# EAGLE schematic controller-ha-v2 (EAGLE 6.5.0)
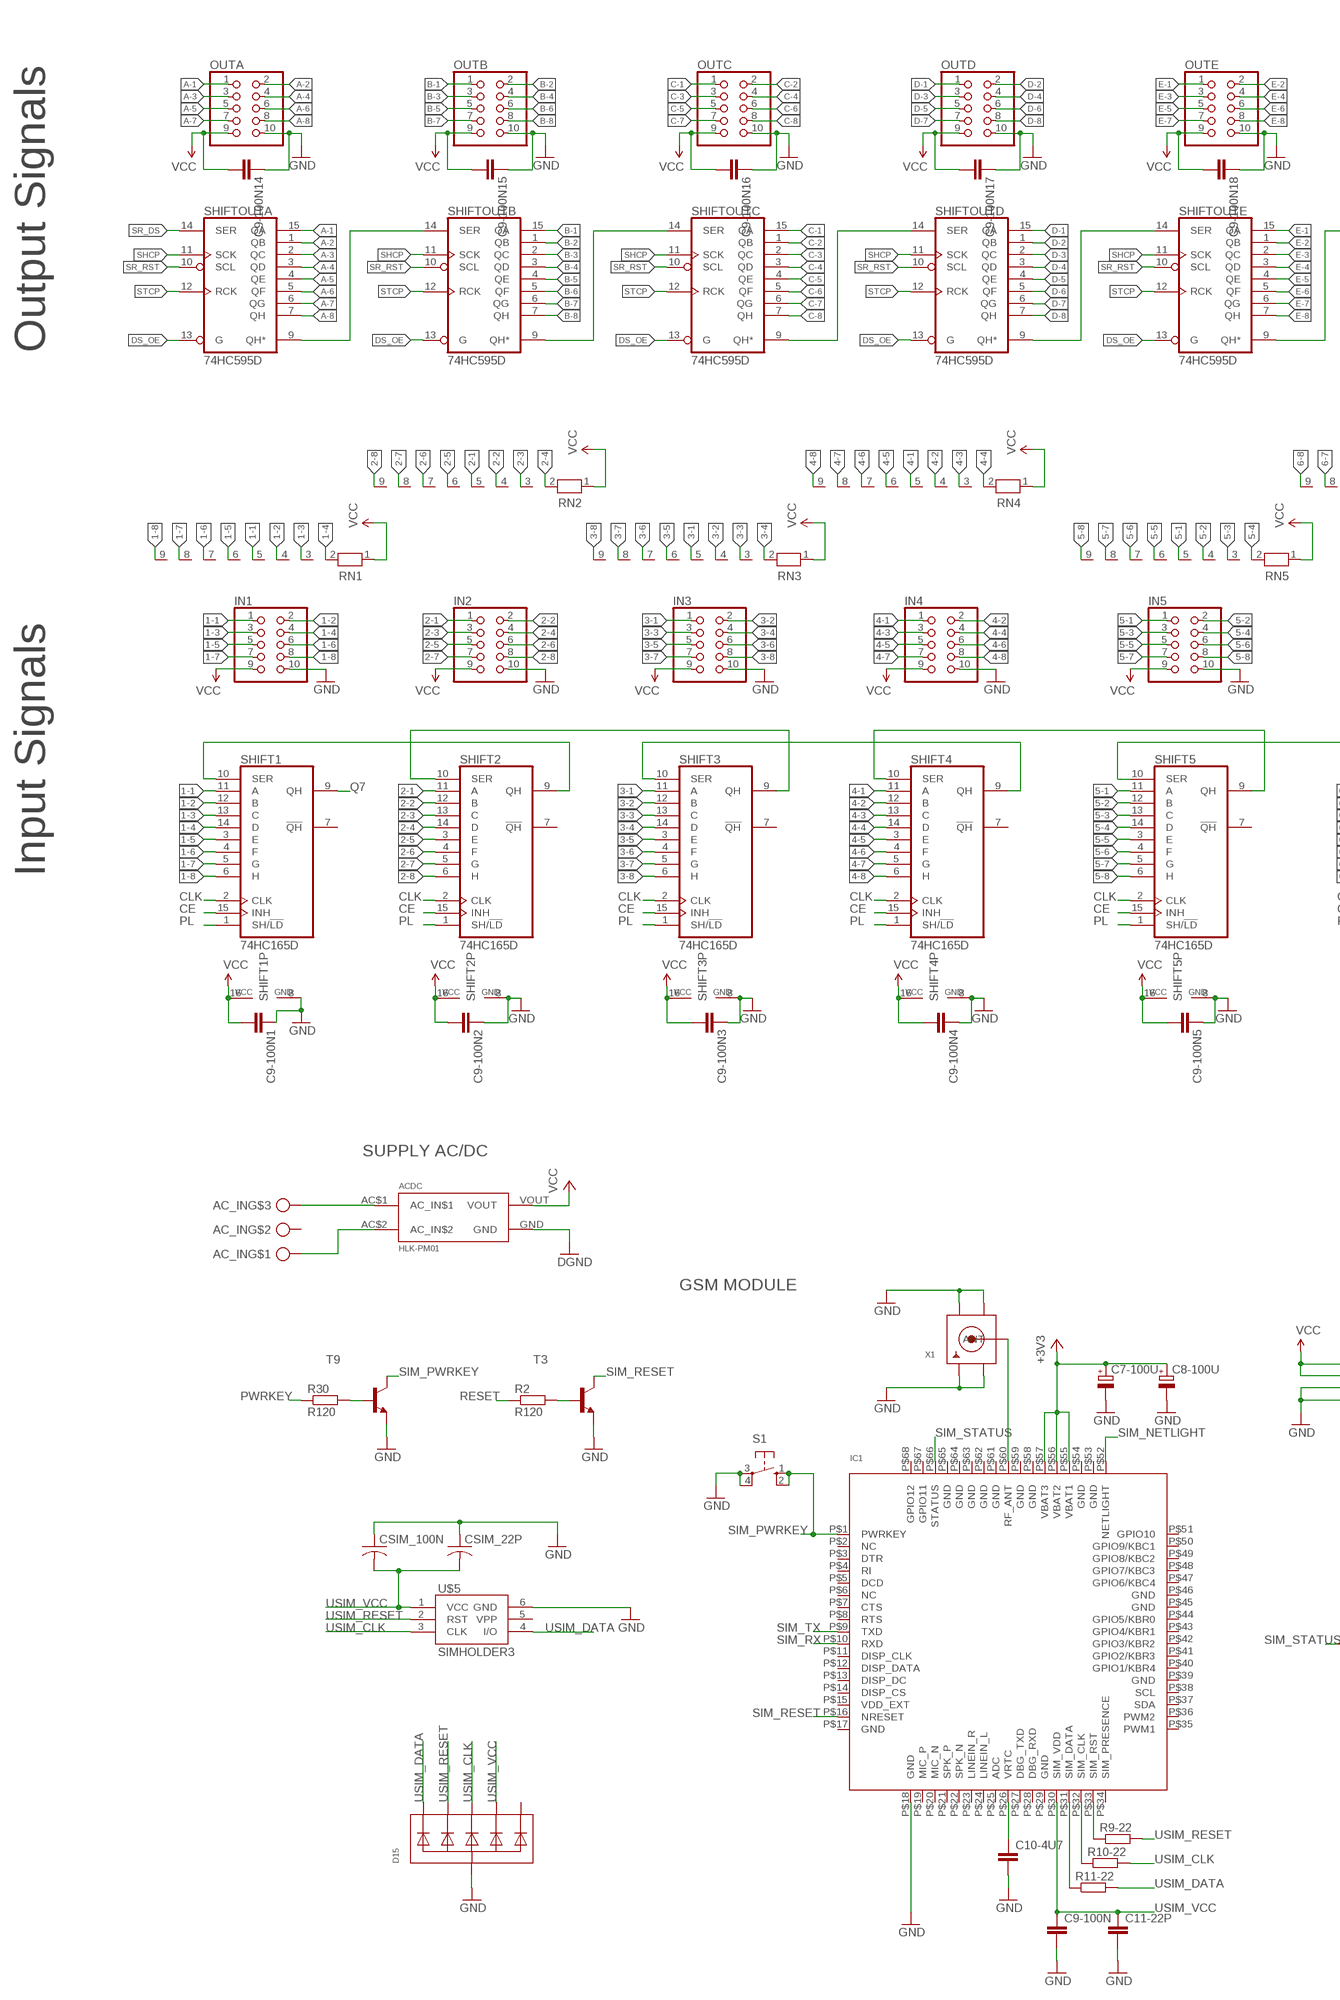
[diagram p0: schematic, sheet 1, part 1 of 2]
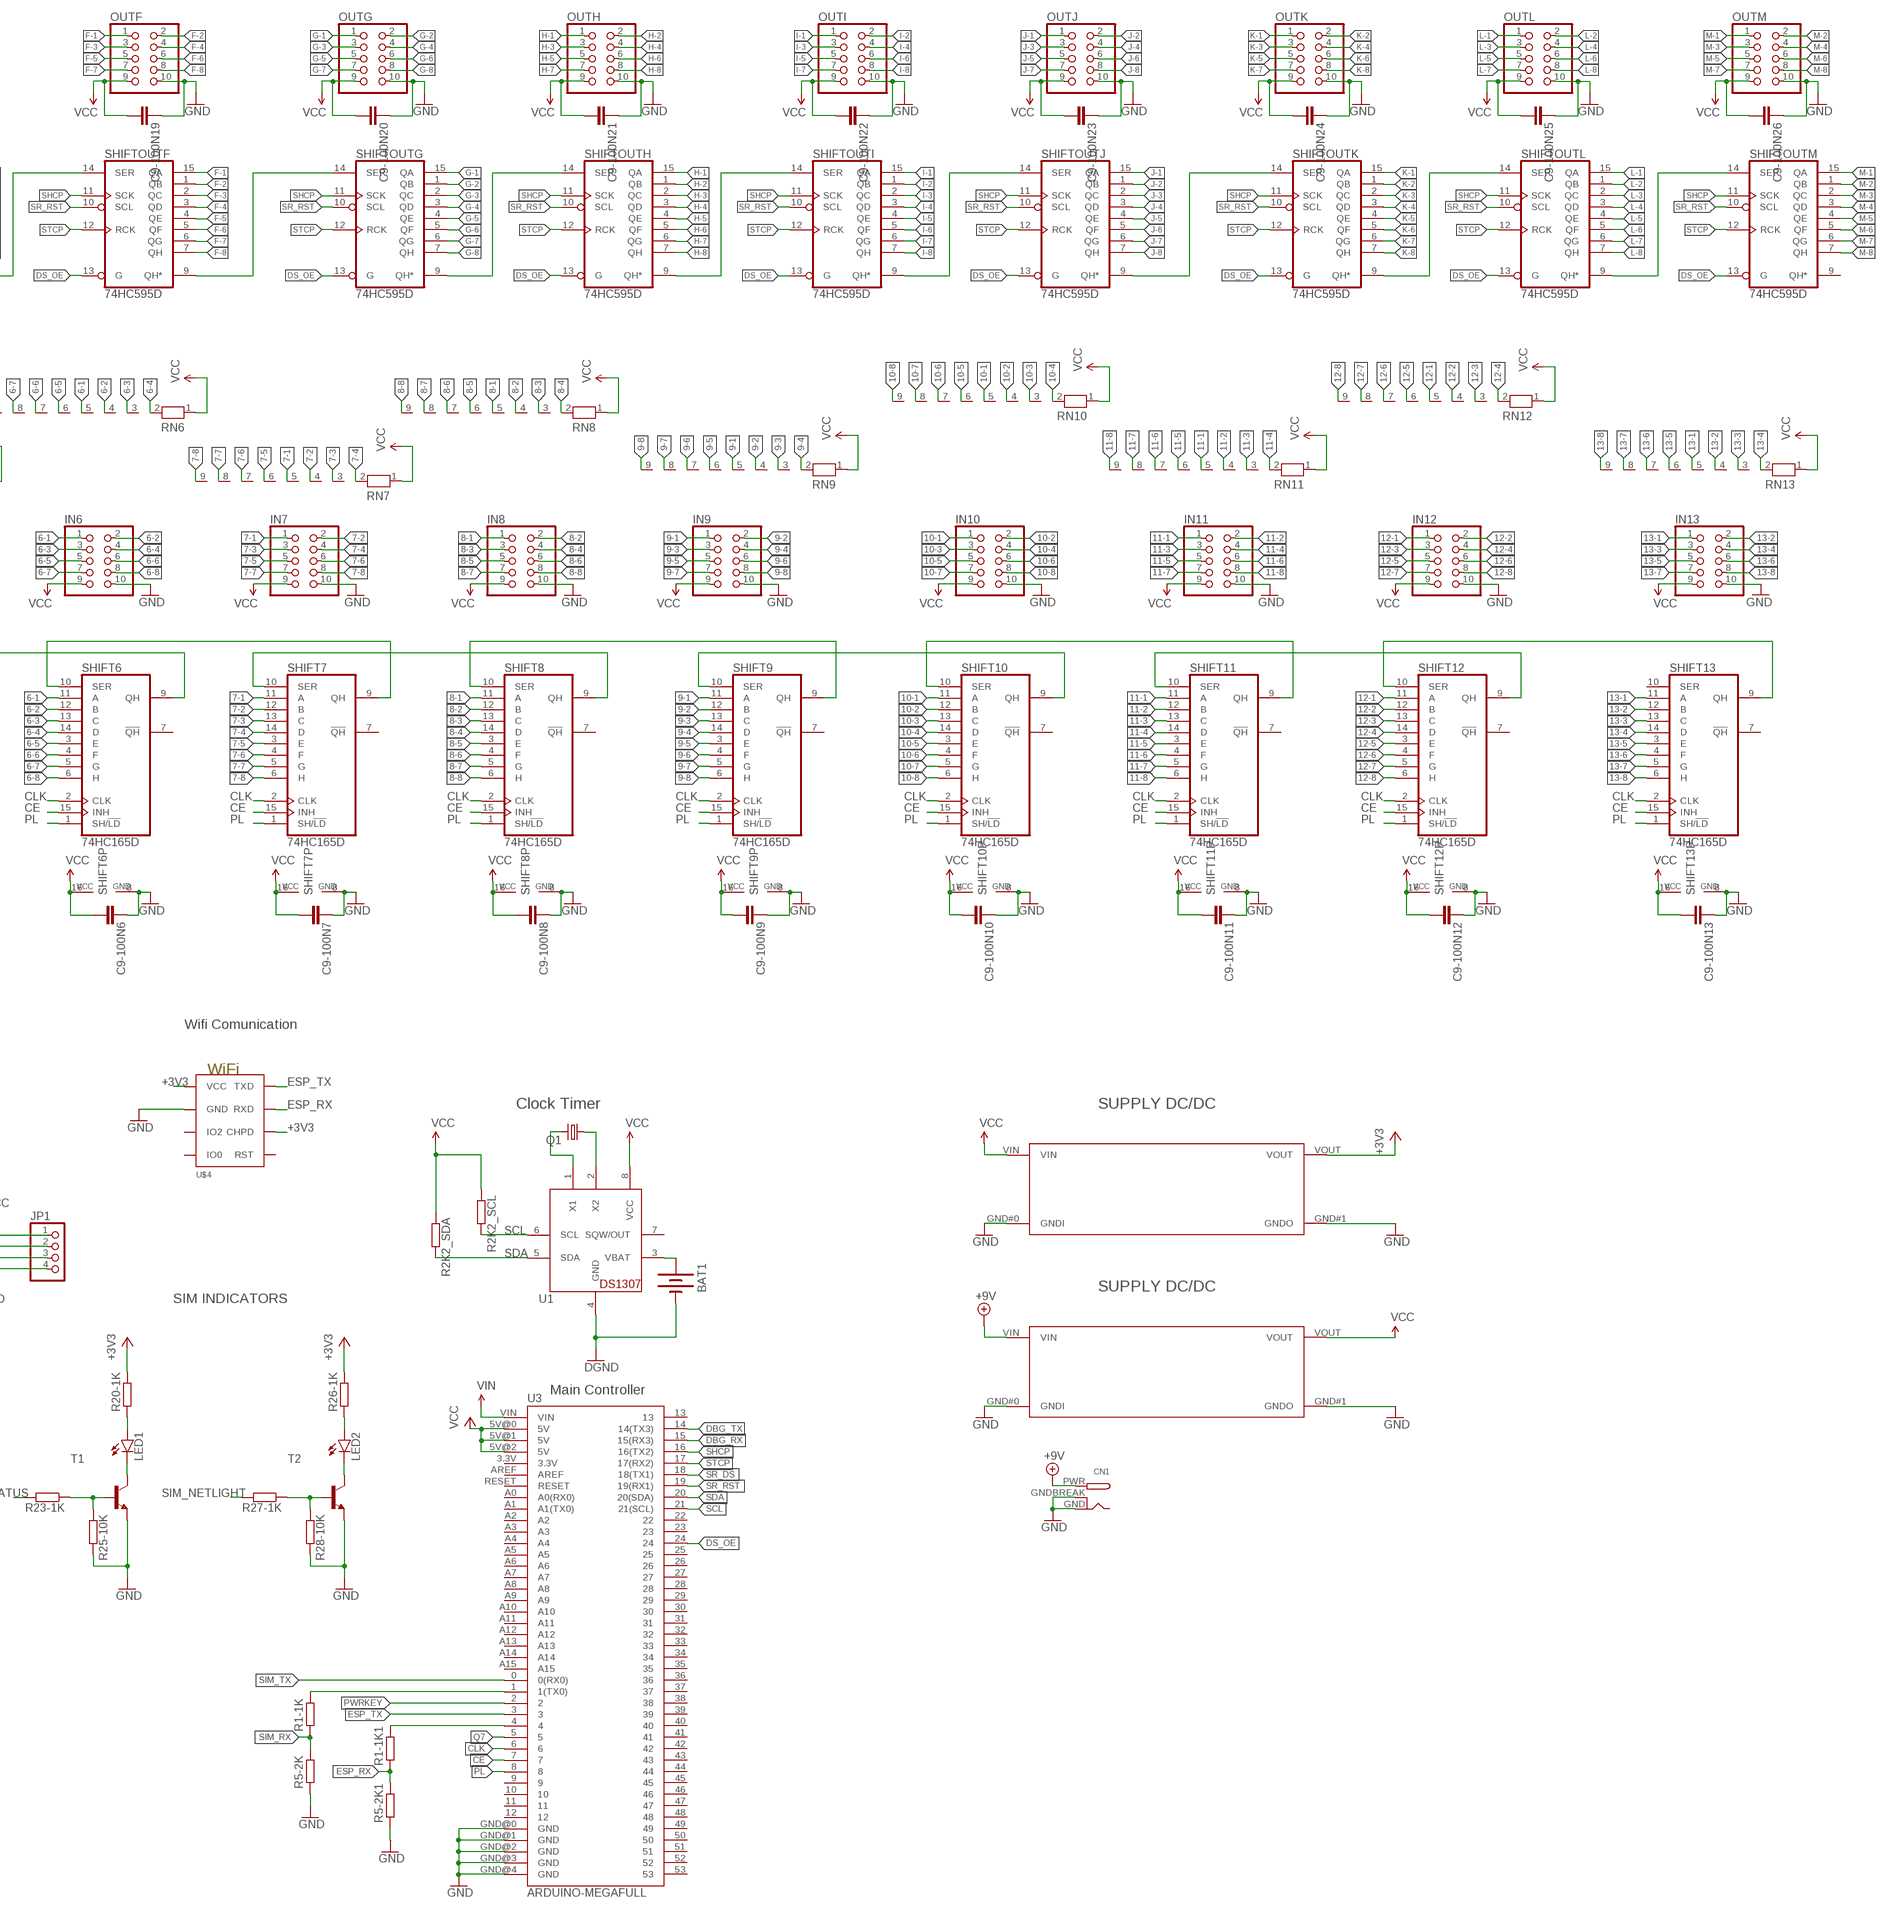
[diagram p1: schematic, sheet 1, part 2 of 2]

## Parts
AC_IN  AK3003  [AK3003]
ACDC  HLK-PM01  [HLK-PM01]
BAT1  BATTERY20PTH  [BATTCOM_20MM_PTH]
C7-100U  CPOL-EU153CLV-0605  [153CLV-0605]
C8-100U  CPOL-EU153CLV-0605  [153CLV-0605]
C9-100N  C-EUC0603  [C0603]
C9-100N1  C-EUC0603  [C0603]
C9-100N2  C-EUC0603  [C0603]
C9-100N3  C-EUC0603  [C0603]
C9-100N4  C-EUC0603  [C0603]
C9-100N5  C-EUC0603  [C0603]
C9-100N6  C-EUC0603  [C0603]
C9-100N7  C-EUC0603  [C0603]
C9-100N8  C-EUC0603  [C0603]
C9-100N9  C-EUC0603  [C0603]
C9-100N10  C-EUC0603  [C0603]
C9-100N11  C-EUC0603  [C0603]
C9-100N12  C-EUC0603  [C0603]
C9-100N13  C-EUC0603  [C0603]
C9-100N14  C-EUC0603  [C0603]
C9-100N15  C-EUC0603  [C0603]
C9-100N16  C-EUC0603  [C0603]
C9-100N17  C-EUC0603  [C0603]
C9-100N18  C-EUC0603  [C0603]
C9-100N19  C-EUC0603  [C0603]
C9-100N20  C-EUC0603  [C0603]
C9-100N21  C-EUC0603  [C0603]
C9-100N22  C-EUC0603  [C0603]
C9-100N23  C-EUC0603  [C0603]
C9-100N24  C-EUC0603  [C0603]
C9-100N25  C-EUC0603  [C0603]
C9-100N26  C-EUC0603  [C0603]
C10-4U7  C-EUC0603  [C0603]
C11-22P  C-EUC0603  [C0603]
CN1  DCBARRELPTH  [DCJACK_2MM_PTH]
CSIM_22P  C-USC0603K  [C0603K]
CSIM_100N  C-USC0603K  [C0603K]
D15  TVSARRAY_5LANE  [SOT363]
IC1  GSM_SIM900_LITERAL  [SIM900_SMT]
IN1  PINHD-2X5  [2X05]
IN2  PINHD-2X5  [2X05]
IN3  PINHD-2X5  [2X05]
IN4  PINHD-2X5  [2X05]
IN5  PINHD-2X5  [2X05]
IN6  PINHD-2X5  [2X05]
IN7  PINHD-2X5  [2X05]
IN8  PINHD-2X5  [2X05]
IN9  PINHD-2X5  [2X05]
IN10  PINHD-2X5  [2X05]
IN11  PINHD-2X5  [2X05]
IN12  PINHD-2X5  [2X05]
IN13  PINHD-2X5  [2X05]
JP1  PINHD-1X4  [1X04]
LED1  LED-3MM-NO_SILK  [LED3MM-NS]
LED2  LED-3MM-NO_SILK  [LED3MM-NS]
OUTA  PINHD-2X5  [2X05]
OUTB  PINHD-2X5  [2X05]
OUTC  PINHD-2X5  [2X05]
OUTD  PINHD-2X5  [2X05]
OUTE  PINHD-2X5  [2X05]
OUTF  PINHD-2X5  [2X05]
OUTG  PINHD-2X5  [2X05]
OUTH  PINHD-2X5  [2X05]
OUTI  PINHD-2X5  [2X05]
OUTJ  PINHD-2X5  [2X05]
OUTK  PINHD-2X5  [2X05]
OUTL  PINHD-2X5  [2X05]
OUTM  PINHD-2X5  [2X05]
Q1  CRYSTALTC26H  [TC26H]
R1-1K  R-EU_R0603  [R0603]
R1-1K1  R-EU_R0603  [R0603]
R2  R120  R-EU_M0805  [M0805]
R2K2_SCL  R-EU_R0603  [R0603]
R2K2_SDA  R-EU_R0603  [R0603]
R5-2K  R-EU_R0603  [R0603]
R5-2K1  R-EU_R0603  [R0603]
R9-22  R-EU_R0603  [R0603]
R10-22  R-EU_R0603  [R0603]
R11-22  R-EU_R0603  [R0603]
R20-1K  R-EU_R0603  [R0603]
R23-1K  R-EU_R0603  [R0603]
R25-10K  R-EU_R0603  [R0603]
R26-1K  R-EU_R0603  [R0603]
R27-1K  R-EU_R0603  [R0603]
R28-10K  R-EU_R0603  [R0603]
R30  R120  R-EU_M0805  [M0805]
RN1  RN08  [RN-9]
RN2  RN08  [RN-9]
RN3  RN08  [RN-9]
RN4  RN08  [RN-9]
RN5  RN08  [RN-9]
RN6  RN08  [RN-9]
RN7  RN08  [RN-9]
RN8  RN08  [RN-9]
RN9  RN08  [RN-9]
RN10  RN08  [RN-9]
RN11  RN08  [RN-9]
RN12  RN08  [RN-9]
RN13  RN08  [RN-9]
S1  10-XX  [B3F-10XX]
SHIFT1  74HC165D  [SO16]
SHIFT2  74HC165D  [SO16]
SHIFT3  74HC165D  [SO16]
SHIFT4  74HC165D  [SO16]
SHIFT5  74HC165D  [SO16]
SHIFT6  74HC165D  [SO16]
SHIFT7  74HC165D  [SO16]
SHIFT8  74HC165D  [SO16]
SHIFT9  74HC165D  [SO16]
SHIFT10  74HC165D  [SO16]
SHIFT11  74HC165D  [SO16]
SHIFT12  74HC165D  [SO16]
SHIFT13  74HC165D  [SO16]
SHIFTOUTA  74HC595D  [SO16]
SHIFTOUTB  74HC595D  [SO16]
SHIFTOUTC  74HC595D  [SO16]
SHIFTOUTD  74HC595D  [SO16]
SHIFTOUTE  74HC595D  [SO16]
SHIFTOUTF  74HC595D  [SO16]
SHIFTOUTG  74HC595D  [SO16]
SHIFTOUTH  74HC595D  [SO16]
SHIFTOUTI  74HC595D  [SO16]
SHIFTOUTJ  74HC595D  [SO16]
SHIFTOUTK  74HC595D  [SO16]
SHIFTOUTL  74HC595D  [SO16]
SHIFTOUTM  74HC595D  [SO16]
T1  MMBT2222ALT1-NPN-SOT23-BEC  [SOT23-BEC]
T2  MMBT2222ALT1-NPN-SOT23-BEC  [SOT23-BEC]
T3  MMBT2222ALT1-NPN-SOT23-BEC  [SOT23-BEC]
T9  MMBT2222ALT1-NPN-SOT23-BEC  [SOT23-BEC]
U1  DS1307  [DIL08]
U3  ARDUINO-MEGAFULL  [ARDUINO_MEGA]
U$1  DCDCMODULE  [DCDCMODULE]
U$2  DCDCMODULE  [DCDCMODULE]
U$4  ESP8266  [ESP8266]
U$5  SIMHOLDER3  [SIMHOLDER3]
X1  SMACONNECTOR  [SMA90_DIP]

## Nets
1-1: IN1.1 RN1.5 SHIFT1.11(A)
1-2: IN1.2 RN1.4 SHIFT1.12(B)
1-3: IN1.3 RN1.3 SHIFT1.13(C)
1-4: IN1.4 RN1.2 SHIFT1.14(D)
1-5: IN1.5 RN1.6 SHIFT1.3(E)
1-6: IN1.6 RN1.7 SHIFT1.4(F)
1-7: IN1.7 RN1.8 SHIFT1.5(G)
1-8: IN1.8 RN1.9 SHIFT1.6(H)
2-1: IN2.1 RN2.5 SHIFT2.11(A)
2-2: IN2.2 RN2.4 SHIFT2.12(B)
2-3: IN2.3 RN2.3 SHIFT2.13(C)
2-4: IN2.4 RN2.2 SHIFT2.14(D)
2-5: IN2.5 RN2.6 SHIFT2.3(E)
2-6: IN2.6 RN2.7 SHIFT2.4(F)
2-7: IN2.7 RN2.8 SHIFT2.5(G)
2-8: IN2.8 RN2.9 SHIFT2.6(H)
3-1: IN3.1 RN3.5 SHIFT3.11(A)
3-2: IN3.2 RN3.4 SHIFT3.12(B)
3-3: IN3.3 RN3.3 SHIFT3.13(C)
3-4: IN3.4 RN3.2 SHIFT3.14(D)
3-5: IN3.5 RN3.6 SHIFT3.3(E)
3-6: IN3.6 RN3.7 SHIFT3.4(F)
3-7: IN3.7 RN3.8 SHIFT3.5(G)
3-8: IN3.8 RN3.9 SHIFT3.6(H)
4-1: IN4.1 RN4.5 SHIFT4.11(A)
4-2: IN4.2 RN4.4 SHIFT4.12(B)
4-3: IN4.3 RN4.3 SHIFT4.13(C)
4-4: IN4.4 RN4.2 SHIFT4.14(D)
4-5: IN4.5 RN4.6 SHIFT4.3(E)
4-6: IN4.6 RN4.7 SHIFT4.4(F)
4-7: IN4.7 RN4.8 SHIFT4.5(G)
4-8: IN4.8 RN4.9 SHIFT4.6(H)
5-1: IN5.1 RN5.5 SHIFT5.11(A)
5-2: IN5.2 RN5.4 SHIFT5.12(B)
5-3: IN5.3 RN5.3 SHIFT5.13(C)
5-4: IN5.4 RN5.2 SHIFT5.14(D)
5-5: IN5.5 RN5.6 SHIFT5.3(E)
5-6: IN5.6 RN5.7 SHIFT5.4(F)
5-7: IN5.7 RN5.8 SHIFT5.5(G)
5-8: IN5.8 RN5.9 SHIFT5.6(H)
6-1: IN6.1 RN6.5 SHIFT6.11(A)
6-2: IN6.2 RN6.4 SHIFT6.12(B)
6-3: IN6.3 RN6.3 SHIFT6.13(C)
6-4: IN6.4 RN6.2 SHIFT6.14(D)
6-5: IN6.5 RN6.6 SHIFT6.3(E)
6-6: IN6.6 RN6.7 SHIFT6.4(F)
6-7: IN6.7 RN6.8 SHIFT6.5(G)
6-8: IN6.8 RN6.9 SHIFT6.6(H)
7-1: IN7.1 RN7.5 SHIFT7.11(A)
7-2: IN7.2 RN7.4 SHIFT7.12(B)
7-3: IN7.3 RN7.3 SHIFT7.13(C)
7-4: IN7.4 RN7.2 SHIFT7.14(D)
7-5: IN7.5 RN7.6 SHIFT7.3(E)
7-6: IN7.6 RN7.7 SHIFT7.4(F)
7-7: IN7.7 RN7.8 SHIFT7.5(G)
7-8: IN7.8 RN7.9 SHIFT7.6(H)
8-1: IN8.1 RN8.5 SHIFT8.11(A)
8-2: IN8.2 RN8.4 SHIFT8.12(B)
8-3: IN8.3 RN8.3 SHIFT8.13(C)
8-4: IN8.4 RN8.2 SHIFT8.14(D)
8-5: IN8.5 RN8.6 SHIFT8.3(E)
8-6: IN8.6 RN8.7 SHIFT8.4(F)
8-7: IN8.7 RN8.8 SHIFT8.5(G)
8-8: IN8.8 RN8.9 SHIFT8.6(H)
9-1: IN9.1 RN9.5 SHIFT9.11(A)
9-2: IN9.2 RN9.4 SHIFT9.12(B)
9-3: IN9.3 RN9.3 SHIFT9.13(C)
9-4: IN9.4 RN9.2 SHIFT9.14(D)
9-5: IN9.5 RN9.6 SHIFT9.3(E)
9-6: IN9.6 RN9.7 SHIFT9.4(F)
9-7: IN9.7 RN9.8 SHIFT9.5(G)
9-8: IN9.8 RN9.9 SHIFT9.6(H)
10-1: IN10.1 RN10.5 SHIFT10.11(A)
10-2: IN10.2 RN10.4 SHIFT10.12(B)
10-3: IN10.3 RN10.3 SHIFT10.13(C)
10-4: IN10.4 RN10.2 SHIFT10.14(D)
10-5: IN10.5 RN10.6 SHIFT10.3(E)
10-6: IN10.6 RN10.7 SHIFT10.4(F)
10-7: IN10.7 RN10.8 SHIFT10.5(G)
10-8: IN10.8 RN10.9 SHIFT10.6(H)
11-1: IN11.1 RN11.5 SHIFT11.11(A)
11-2: IN11.2 RN11.4 SHIFT11.12(B)
11-3: IN11.3 RN11.3 SHIFT11.13(C)
11-4: IN11.4 RN11.2 SHIFT11.14(D)
11-5: IN11.5 RN11.6 SHIFT11.3(E)
11-6: IN11.6 RN11.7 SHIFT11.4(F)
11-7: IN11.7 RN11.8 SHIFT11.5(G)
11-8: IN11.8 RN11.9 SHIFT11.6(H)
12-1: IN12.1 RN12.5 SHIFT12.11(A)
12-2: IN12.2 RN12.4 SHIFT12.12(B)
12-3: IN12.3 RN12.3 SHIFT12.13(C)
12-4: IN12.4 RN12.2 SHIFT12.14(D)
12-5: IN12.5 RN12.6 SHIFT12.3(E)
12-6: IN12.6 RN12.7 SHIFT12.4(F)
12-7: IN12.7 RN12.8 SHIFT12.5(G)
12-8: IN12.8 RN12.9 SHIFT12.6(H)
13-1: IN13.1 RN13.5 SHIFT13.11(A)
13-2: IN13.2 RN13.4 SHIFT13.12(B)
13-3: IN13.3 RN13.3 SHIFT13.13(C)
13-4: IN13.4 RN13.2 SHIFT13.14(D)
13-5: IN13.5 RN13.6 SHIFT13.3(E)
13-6: IN13.6 RN13.7 SHIFT13.4(F)
13-7: IN13.7 RN13.8 SHIFT13.5(G)
13-8: IN13.8 RN13.9 SHIFT13.6(H)
+3V3: C7-100U.+ C8-100U.+ IC1.P$55(VBAT1) IC1.P$56(VBAT2) IC1.P$57(VBAT3) R20-1K.2 R26-1K.2 U$2.VOUT U$4.CHPD U$4.VCC
+9V [GND]: CN1.PWR U$1.VIN
A-1: OUTA.1 SHIFTOUTA.15(QA)
A-2: OUTA.2 SHIFTOUTA.1(QB)
A-3: OUTA.3 SHIFTOUTA.2(QC)
A-4: OUTA.4 SHIFTOUTA.3(QD)
A-5: OUTA.5 SHIFTOUTA.4(QE)
A-6: OUTA.6 SHIFTOUTA.5(QF)
A-7: OUTA.7 SHIFTOUTA.6(QG)
A-8: OUTA.8 SHIFTOUTA.7(QH)
B-1: OUTB.1 SHIFTOUTB.15(QA)
B-2: OUTB.2 SHIFTOUTB.1(QB)
B-3: OUTB.3 SHIFTOUTB.2(QC)
B-4: OUTB.4 SHIFTOUTB.3(QD)
B-5: OUTB.5 SHIFTOUTB.4(QE)
B-6: OUTB.6 SHIFTOUTB.5(QF)
B-7: OUTB.7 SHIFTOUTB.6(QG)
B-8: OUTB.8 SHIFTOUTB.7(QH)
C-1: OUTC.1 SHIFTOUTC.15(QA)
C-2: OUTC.2 SHIFTOUTC.1(QB)
C-3: OUTC.3 SHIFTOUTC.2(QC)
C-4: OUTC.4 SHIFTOUTC.3(QD)
C-5: OUTC.5 SHIFTOUTC.4(QE)
C-6: OUTC.6 SHIFTOUTC.5(QF)
C-7: OUTC.7 SHIFTOUTC.6(QG)
C-8: OUTC.8 SHIFTOUTC.7(QH)
CE: SHIFT1.15(INH) SHIFT2.15(INH) SHIFT3.15(INH) SHIFT4.15(INH) SHIFT5.15(INH) SHIFT6.15(INH) SHIFT7.15(INH) SHIFT8.15(INH) SHIFT9.15(INH) SHIFT10.15(INH) SHIFT11.15(INH) SHIFT12.15(INH) SHIFT13.15(INH) U3.7
CLK: SHIFT1.2(CLK) SHIFT2.2(CLK) SHIFT3.2(CLK) SHIFT4.2(CLK) SHIFT5.2(CLK) SHIFT6.2(CLK) SHIFT7.2(CLK) SHIFT8.2(CLK) SHIFT9.2(CLK) SHIFT10.2(CLK) SHIFT11.2(CLK) SHIFT12.2(CLK) SHIFT13.2(CLK) U3.6
D-1: OUTD.1 SHIFTOUTD.15(QA)
D-2: OUTD.2 SHIFTOUTD.1(QB)
D-3: OUTD.3 SHIFTOUTD.2(QC)
D-4: OUTD.4 SHIFTOUTD.3(QD)
D-5: OUTD.5 SHIFTOUTD.4(QE)
D-6: OUTD.6 SHIFTOUTD.5(QF)
D-7: OUTD.7 SHIFTOUTD.6(QG)
D-8: OUTD.8 SHIFTOUTD.7(QH)
DBG_RX: U3.15(15(RX3))
DBG_TX: U3.14(14(TX3))
DS_OE: SHIFTOUTA.13(G) SHIFTOUTB.13(G) SHIFTOUTC.13(G) SHIFTOUTD.13(G) SHIFTOUTE.13(G) SHIFTOUTF.13(G) SHIFTOUTG.13(G) SHIFTOUTH.13(G) SHIFTOUTI.13(G) SHIFTOUTJ.13(G) SHIFTOUTK.13(G) SHIFTOUTL.13(G) SHIFTOUTM.13(G) U3.24
E-1: OUTE.1 SHIFTOUTE.15(QA)
E-2: OUTE.2 SHIFTOUTE.1(QB)
E-3: OUTE.3 SHIFTOUTE.2(QC)
E-4: OUTE.4 SHIFTOUTE.3(QD)
E-5: OUTE.5 SHIFTOUTE.4(QE)
E-6: OUTE.6 SHIFTOUTE.5(QF)
E-7: OUTE.7 SHIFTOUTE.6(QG)
E-8: OUTE.8 SHIFTOUTE.7(QH)
ESP_RX: R1-1K1.1 R5-2K1.2 U$4.RXD
ESP_TX: U3.3 U$4.TXD
F-1: OUTF.1 SHIFTOUTF.15(QA)
F-2: OUTF.2 SHIFTOUTF.1(QB)
F-3: OUTF.3 SHIFTOUTF.2(QC)
F-4: OUTF.4 SHIFTOUTF.3(QD)
F-5: OUTF.5 SHIFTOUTF.4(QE)
F-6: OUTF.6 SHIFTOUTF.5(QF)
F-7: OUTF.7 SHIFTOUTF.6(QG)
F-8: OUTF.8 SHIFTOUTF.7(QH)
G-1: OUTG.1 SHIFTOUTG.15(QA)
G-2: OUTG.2 SHIFTOUTG.1(QB)
G-3: OUTG.3 SHIFTOUTG.2(QC)
G-4: OUTG.4 SHIFTOUTG.3(QD)
G-5: OUTG.5 SHIFTOUTG.4(QE)
G-6: OUTG.6 SHIFTOUTG.5(QF)
G-7: OUTG.7 SHIFTOUTG.6(QG)
G-8: OUTG.8 SHIFTOUTG.7(QH)
GND [GND]: ACDC.GND BAT1.2(-) C7-100U.- C8-100U.- C9-100N1.1 C9-100N2.1 C9-100N3.1 C9-100N4.1 C9-100N5.1 C9-100N6.1 C9-100N7.1 C9-100N8.1 C9-100N9.1 C9-100N10.1 C9-100N11.1 C9-100N12.1 C9-100N13.1 C9-100N14.1 C9-100N15.1 C9-100N16.1 C9-100N17.1 C9-100N18.1 C9-100N19.1 C9-100N20.1 C9-100N21.1 C9-100N22.1 C9-100N23.1 C9-100N24.1 C9-100N25.1 C9-100N26.1 C9-100N.2 C10-4U7.2 C11-22P.2 CN1.GND CN1.GNDBREAK CSIM_22P.1 CSIM_100N.1 D15.2(A) IC1.P$18(GND) IN1.10 IN2.10 IN3.10 IN4.10 IN5.10 IN6.10 IN7.10 IN8.10 IN9.10 IN10.10 IN11.10 IN12.10 IN13.10 JP1.3 JP1.4 OUTA.10 OUTB.10 OUTC.10 OUTD.10 OUTE.10 OUTF.10 OUTG.10 OUTH.10 OUTI.10 OUTJ.10 OUTK.10 OUTL.10 OUTM.10 R5-2K1.1 R5-2K.1 R25-10K.2 R28-10K.2 S1.3(P) S1.4(P1) SHIFT1.8(GND) SHIFT2.8(GND) SHIFT3.8(GND) SHIFT4.8(GND) SHIFT5.8(GND) SHIFT6.8(GND) SHIFT7.8(GND) SHIFT8.8(GND) SHIFT9.8(GND) SHIFT10.8(GND) SHIFT11.8(GND) SHIFT12.8(GND) SHIFT13.8(GND) T1.E T2.E T3.E T9.E U1.4(GND) U3.GND@0(GND) U3.GND@1(GND) U3.GND@2(GND) U3.GND@3(GND) U3.GND@4(GND) U$1.GND#0(GNDI) U$1.GND#1(GNDO) U$2.GND#0(GNDI) U$2.GND#1(GNDO) U$4.GND U$5.6(GND) X1.GND1 X1.GND2 X1.GND3 X1.GND4 ; supply symbol labelled DGND
H-1: OUTH.1 SHIFTOUTH.15(QA)
H-2: OUTH.2 SHIFTOUTH.1(QB)
H-3: OUTH.3 SHIFTOUTH.2(QC)
H-4: OUTH.4 SHIFTOUTH.3(QD)
H-5: OUTH.5 SHIFTOUTH.4(QE)
H-6: OUTH.6 SHIFTOUTH.5(QF)
H-7: OUTH.7 SHIFTOUTH.6(QG)
H-8: OUTH.8 SHIFTOUTH.7(QH)
I-1: OUTI.1 SHIFTOUTI.15(QA)
I-2: OUTI.2 SHIFTOUTI.1(QB)
I-3: OUTI.3 SHIFTOUTI.2(QC)
I-4: OUTI.4 SHIFTOUTI.3(QD)
I-5: OUTI.5 SHIFTOUTI.4(QE)
I-6: OUTI.6 SHIFTOUTI.5(QF)
I-7: OUTI.7 SHIFTOUTI.6(QG)
I-8: OUTI.8 SHIFTOUTI.7(QH)
J-1: OUTJ.1 SHIFTOUTJ.15(QA)
J-2: OUTJ.2 SHIFTOUTJ.1(QB)
J-3: OUTJ.3 SHIFTOUTJ.2(QC)
J-4: OUTJ.4 SHIFTOUTJ.3(QD)
J-5: OUTJ.5 SHIFTOUTJ.4(QE)
J-6: OUTJ.6 SHIFTOUTJ.5(QF)
J-7: OUTJ.7 SHIFTOUTJ.6(QG)
J-8: OUTJ.8 SHIFTOUTJ.7(QH)
K-1: OUTK.1 SHIFTOUTK.15(QA)
K-2: OUTK.2 SHIFTOUTK.1(QB)
K-3: OUTK.3 SHIFTOUTK.2(QC)
K-4: OUTK.4 SHIFTOUTK.3(QD)
K-5: OUTK.5 SHIFTOUTK.4(QE)
K-6: OUTK.6 SHIFTOUTK.5(QF)
K-7: OUTK.7 SHIFTOUTK.6(QG)
K-8: OUTK.8 SHIFTOUTK.7(QH)
L-1: OUTL.1 SHIFTOUTL.15(QA)
L-2: OUTL.2 SHIFTOUTL.1(QB)
L-3: OUTL.3 SHIFTOUTL.2(QC)
L-4: OUTL.4 SHIFTOUTL.3(QD)
L-5: OUTL.5 SHIFTOUTL.4(QE)
L-6: OUTL.6 SHIFTOUTL.5(QF)
L-7: OUTL.7 SHIFTOUTL.6(QG)
L-8: OUTL.8 SHIFTOUTL.7(QH)
M-1: OUTM.1 SHIFTOUTM.15(QA)
M-2: OUTM.2 SHIFTOUTM.1(QB)
M-3: OUTM.3 SHIFTOUTM.2(QC)
M-4: OUTM.4 SHIFTOUTM.3(QD)
M-5: OUTM.5 SHIFTOUTM.4(QE)
M-6: OUTM.6 SHIFTOUTM.5(QF)
M-7: OUTM.7 SHIFTOUTM.6(QG)
M-8: OUTM.8 SHIFTOUTM.7(QH)
N$1: R1-1K.2 U3.1(1(TX0))
N$2: IC1.P$31(SIM_DATA) R11-22.1
N$3: IC1.P$32(SIM_CLK) R10-22.1
N$4: IC1.P$33(SIM_RST) R9-22.1
N$5: C10-4U7.1 IC1.P$26(VRTC)
N$6: IC1.P$60(RF_ANT) X1.ANTENNA(ANT)
N$7: AC_IN.3 ACDC.AC$1(AC_IN$1)
N$8: LED1.A R20-1K.1
N$9: LED1.K(C) T1.C
N$10: R23-1K.1 R25-10K.1 T1.B
N$11: LED2.A R26-1K.1
N$12: LED2.K(C) T2.C
N$13: R27-1K.1 R28-10K.1 T2.B
N$14: R30.2 T9.B
N$15: R2.2 T3.B
N$16: Q1.1 U1.2(X2)
N$17: AC_IN.1 ACDC.AC$2(AC_IN$2)
N$18: SHIFT2.10(SER) SHIFT3.9(QH)
N$19: Q1.2 U1.1(X1)
N$20: R1-1K1.2 U3.4
N$21: SHIFT3.10(SER) SHIFT4.9(QH)
N$22: SHIFT4.10(SER) SHIFT5.9(QH)
N$23: BAT1.1(+) U1.3(VBAT)
N$24: SHIFT5.10(SER) SHIFT6.9(QH)
N$25: SHIFT7.10(SER) SHIFT8.9(QH)
N$26: SHIFTOUTA.9(QH*) SHIFTOUTB.14(SER)
N$27: SHIFT8.10(SER) SHIFT9.9(QH)
N$28: SHIFT12.10(SER) SHIFT13.9(QH)
N$29: SHIFT11.10(SER) SHIFT12.9(QH)
N$30: SHIFT10.10(SER) SHIFT11.9(QH)
N$31: SHIFTOUTC.9(QH*) SHIFTOUTD.14(SER)
N$32: SHIFTOUTE.9(QH*) SHIFTOUTF.14(SER)
N$33: SHIFTOUTG.9(QH*) SHIFTOUTH.14(SER)
N$34: SHIFTOUTI.9(QH*) SHIFTOUTJ.14(SER)
N$35: SHIFTOUTK.9(QH*) SHIFTOUTL.14(SER)
N$36: SHIFT6.10(SER) SHIFT7.9(QH)
N$37: SHIFTOUTB.9(QH*) SHIFTOUTC.14(SER)
N$38: SHIFTOUTD.9(QH*) SHIFTOUTE.14(SER)
N$39: SHIFTOUTF.9(QH*) SHIFTOUTG.14(SER)
N$40: SHIFTOUTH.9(QH*) SHIFTOUTI.14(SER)
N$41: SHIFTOUTJ.9(QH*) SHIFTOUTK.14(SER)
N$42: SHIFTOUTL.9(QH*) SHIFTOUTM.14(SER)
N$50: SHIFT1.10(SER) SHIFT2.9(QH)
N$121: SHIFT9.10(SER) SHIFT10.9(QH)
PL: SHIFT1.1(SH/!LD) SHIFT2.1(SH/!LD) SHIFT3.1(SH/!LD) SHIFT4.1(SH/!LD) SHIFT5.1(SH/!LD) SHIFT6.1(SH/!LD) SHIFT7.1(SH/!LD) SHIFT8.1(SH/!LD) SHIFT9.1(SH/!LD) SHIFT10.1(SH/!LD) SHIFT11.1(SH/!LD) SHIFT12.1(SH/!LD) SHIFT13.1(SH/!LD) U3.8
PWRKEY: R30.1 U3.2
Q7: SHIFT1.9(QH) U3.5
RESET: R2.1
SCL: R2K2_SCL.2 U1.6(SCL) U3.21(21(SCL))
SDA: R2K2_SDA.2 U1.5(SDA) U3.20(20(SDA))
SHCP: SHIFTOUTA.11(SCK) SHIFTOUTB.11(SCK) SHIFTOUTC.11(SCK) SHIFTOUTD.11(SCK) SHIFTOUTE.11(SCK) SHIFTOUTF.11(SCK) SHIFTOUTG.11(SCK) SHIFTOUTH.11(SCK) SHIFTOUTI.11(SCK) SHIFTOUTJ.11(SCK) SHIFTOUTK.11(SCK) SHIFTOUTL.11(SCK) SHIFTOUTM.11(SCK) U3.16(16(TX2))
SIM_NETLIGHT: IC1.P$52(NETLIGHT) R27-1K.2
SIM_PWRKEY: IC1.P$1(PWRKEY) S1.1(S) S1.2(S1) T9.C
SIM_RESET: IC1.P$16(NRESET) T3.C
SIM_RX: IC1.P$10(RXD) R1-1K.1 R5-2K.2
SIM_STATUS: IC1.P$66(STATUS) R23-1K.2
SIM_TX: IC1.P$9(TXD) U3.0(0(RX0))
SR_DS: SHIFTOUTA.14(SER) U3.18(18(TX1))
SR_RST: SHIFTOUTA.10(SCL) SHIFTOUTB.10(SCL) SHIFTOUTC.10(SCL) SHIFTOUTD.10(SCL) SHIFTOUTE.10(SCL) SHIFTOUTF.10(SCL) SHIFTOUTG.10(SCL) SHIFTOUTH.10(SCL) SHIFTOUTI.10(SCL) SHIFTOUTJ.10(SCL) SHIFTOUTK.10(SCL) SHIFTOUTL.10(SCL) SHIFTOUTM.10(SCL) U3.19(19(RX1))
STCP: SHIFTOUTA.12(RCK) SHIFTOUTB.12(RCK) SHIFTOUTC.12(RCK) SHIFTOUTD.12(RCK) SHIFTOUTE.12(RCK) SHIFTOUTF.12(RCK) SHIFTOUTG.12(RCK) SHIFTOUTH.12(RCK) SHIFTOUTI.12(RCK) SHIFTOUTJ.12(RCK) SHIFTOUTK.12(RCK) SHIFTOUTL.12(RCK) SHIFTOUTM.12(RCK) U3.17(17(RX2))
USIM_CLK: D15.4(C3) R10-22.2 U$5.3(CLK)
USIM_DATA: D15.1(C1) R11-22.2 U$5.4(I/O)
USIM_RESET: D15.3(C2) R9-22.2 U$5.2(RST)
USIM_VCC: C9-100N.1 C11-22P.1 CSIM_22P.2 CSIM_100N.2 D15.5(C4) IC1.P$30(SIM_VDD) U$5.1(VCC)
VCC [power]: ACDC.VOUT C9-100N1.2 C9-100N2.2 C9-100N3.2 C9-100N4.2 C9-100N5.2 C9-100N6.2 C9-100N7.2 C9-100N8.2 C9-100N9.2 C9-100N10.2 C9-100N11.2 C9-100N12.2 C9-100N13.2 C9-100N14.2 C9-100N15.2 C9-100N16.2 C9-100N17.2 C9-100N18.2 C9-100N19.2 C9-100N20.2 C9-100N21.2 C9-100N22.2 C9-100N23.2 C9-100N24.2 C9-100N25.2 C9-100N26.2 IN1.9 IN2.9 IN3.9 IN4.9 IN5.9 IN6.9 IN7.9 IN8.9 IN9.9 IN10.9 IN11.9 IN12.9 IN13.9 JP1.1 JP1.2 OUTA.9 OUTB.9 OUTC.9 OUTD.9 OUTE.9 OUTF.9 OUTG.9 OUTH.9 OUTI.9 OUTJ.9 OUTK.9 OUTL.9 OUTM.9 R2K2_SCL.1 R2K2_SDA.1 RN1.1 RN2.1 RN3.1 RN4.1 RN5.1 RN6.1 RN7.1 RN8.1 RN9.1 RN10.1 RN11.1 RN12.1 RN13.1 SHIFT1.16(VCC) SHIFT2.16(VCC) SHIFT3.16(VCC) SHIFT4.16(VCC) SHIFT5.16(VCC) SHIFT6.16(VCC) SHIFT7.16(VCC) SHIFT8.16(VCC) SHIFT9.16(VCC) SHIFT10.16(VCC) SHIFT11.16(VCC) SHIFT12.16(VCC) SHIFT13.16(VCC) U1.8(VCC) U3.5V@0(5V) U3.5V@1(5V) U3.5V@2(5V) U$1.VOUT U$2.VIN
VIN: U3.VIN
Unconnected: AC_IN.2 D15.6(C5) IC1.P$2(NC) IC1.P$3(DTR) IC1.P$4(RI) IC1.P$5(DCD) IC1.P$6(NC) IC1.P$7(CTS) IC1.P$8(RTS) IC1.P$11(DISP_CLK) IC1.P$12(DISP_DATA) IC1.P$13(DISP_DC) IC1.P$14(DISP_CS) IC1.P$15(VDD_EXT) IC1.P$19(MIC_P) IC1.P$20(MIC_N) IC1.P$21(SPK_P) IC1.P$22(SPK_N) IC1.P$23(LINEIN_R) IC1.P$24(LINEIN_L) IC1.P$25(ADC) IC1.P$27(DBG_TXD) IC1.P$28(DBG_RXD) IC1.P$34(SIM_PRESENCE) IC1.P$35(PWM1) IC1.P$36(PWM2) IC1.P$37(SDA) IC1.P$38(SCL) IC1.P$40(GPIO1/KBR4) IC1.P$41(GPIO2/KBR3) IC1.P$42(GPIO3/KBR2) IC1.P$43(GPIO4/KBR1) IC1.P$44(GPIO5/KBR0) IC1.P$47(GPIO6/KBC4) IC1.P$48(GPIO7/KBC3) IC1.P$49(GPIO8/KBC2) IC1.P$50(GPIO9/KBC1) IC1.P$51(GPIO10) SHIFT1.7(!QH) SHIFT2.7(!QH) SHIFT3.7(!QH) SHIFT4.7(!QH) SHIFT5.7(!QH) SHIFT6.7(!QH) SHIFT7.7(!QH) SHIFT8.7(!QH) SHIFT9.7(!QH) SHIFT10.7(!QH) SHIFT11.7(!QH) SHIFT12.7(!QH) SHIFT13.7(!QH) SHIFT13.10(SER) SHIFTOUTM.9(QH*) U1.7(SQW/OUT) U3.3.3V U3.9 U3.10 U3.11 U3.12 U3.13 U3.22 U3.23 U3.25 U3.26 U3.27 U3.28 U3.29 U3.30 U3.31 U3.32 U3.33 U3.34 U3.35 U3.36 U3.37 U3.38 U3.39 U3.40 U3.41 U3.42 U3.43 U3.44 U3.45 U3.46 U3.47 U3.48 U3.49 U3.50 U3.51 U3.52 U3.53 U3.A0(A0(RX0)) U3.A1(A1(TX0)) U3.A2 U3.A3 U3.A4 U3.A5 U3.A6 U3.A7 U3.A8 U3.A9 U3.A10 U3.A11 U3.A12 U3.A13 U3.A14 U3.A15 U3.AREF U3.RESET U$4.IO0 U$4.IO2 U$4.RST U$5.5(VPP)

## Notes on the sheet
- Output Signals
- Input Signals
- Wifi Comunication
- SUPPLY AC/DC
- WiFi
- Clock Timer | SUPPLY DC/DC
- GSM MODULE
- SUPPLY DC/DC
- SIM INDICATORS
- Main Controller

## Power pins joined to a net without a drawn wire
GND: IC1.P$17(GND) IC1.P$29(GND) IC1.P$39(GND) IC1.P$45(GND) IC1.P$46(GND) IC1.P$53(GND) IC1.P$54(GND) IC1.P$58(GND) IC1.P$59(GND) IC1.P$61(GND) IC1.P$62(GND) IC1.P$63(GND) IC1.P$64(GND) IC1.P$65(GND) SHIFTOUTA.8(GND) SHIFTOUTB.8(GND) SHIFTOUTC.8(GND) SHIFTOUTD.8(GND) SHIFTOUTE.8(GND) SHIFTOUTF.8(GND) SHIFTOUTG.8(GND) SHIFTOUTH.8(GND) SHIFTOUTI.8(GND) SHIFTOUTJ.8(GND) SHIFTOUTK.8(GND) SHIFTOUTL.8(GND) SHIFTOUTM.8(GND)
GPIO11: IC1.P$67(GPIO11)
GPIO12: IC1.P$68(GPIO12)
VCC: SHIFTOUTA.16(VCC) SHIFTOUTB.16(VCC) SHIFTOUTC.16(VCC) SHIFTOUTD.16(VCC) SHIFTOUTE.16(VCC) SHIFTOUTF.16(VCC) SHIFTOUTG.16(VCC) SHIFTOUTH.16(VCC) SHIFTOUTI.16(VCC) SHIFTOUTJ.16(VCC) SHIFTOUTK.16(VCC) SHIFTOUTL.16(VCC) SHIFTOUTM.16(VCC)

## Library data of the parts
AC_IN = con-ptr500:AK3003
ACDC = bontor:HLK-PM01
BAT1 = SparkFun-Electromechanical:BATTERY: Battery Holders Various common sizes : AA, AAA, 20mm coin cell and 12mm coin cell. 20MM_4LEGS, BATT-10373
C7-100U C8-100U = rcl:CPOL-EU: POLARIZED CAPACITOR, European symbol
C9-100N C9-100N1-C9-100N26 C10-4U7 C11-22P = rcl:C-EU: CAPACITOR, European symbol
CN1 = adafruit:DCBARREL: 2.0mm DC Barrel Jack DCJACK_2MM_PTH - Through Hole Jack (4UConnector: 05537)
CSIM_22P CSIM_100N = rcl:C-US: CAPACITOR, American symbol
D15 = microbuilder:TVSARRAY_5LANE: Voltage Transient Suppressor Array SOT363 SMF05C - 100W 5V: Digikey - SMF05CT1GOSCT-ND
IC1 = microbuilder:GSM_SIM900_LITERAL: SIM900 Quad-Band GSM/GPRS Module Power Supply: 3.2-4.8V Temperature Range: -30°C-+80°C Bands: GSM 850, EGSM 900, DCS 1800, PCS 1900
IN1-IN13 OUTA OUTB OUTC OUTD OUTE OUTF OUTG OUTH OUTI OUTJ OUTK OUTL OUTM = pinhead:PINHD-2X5: PIN HEADER
JP1 = pinhead:PINHD-1X4: PIN HEADER
LED1 LED2 = SparkFun-LED:LED: LEDs Standard schematic elements and footprints for 5mm, 3mm, 1206, and 0603 sized LEDs. 5mm - Spark Fun Electronics SKU : COM-00529 (and others)
Q1 = crystal:CRYSTAL: CRYSTAL; OC_FARNELL: unknown; OC_NEWARK: unknown
R1-1K R1-1K1 R2K2_SCL R2K2_SDA R5-2K R5-2K1 R9-22 R10-22 R11-22 R20-1K R23-1K R25-10K R26-1K R27-1K R28-10K = rcl:R-EU_: RESISTOR, European symbol
R2 R30 = resistor:R-EU_: RESISTOR, European symbol
RN1-RN13 = resistor-net:RN08: RESISTOR NETWORK; OC_FARNELL: unknown; OC_NEWARK: unknown
S1 = switch-omron:10-XX: OMRON SWITCH; MPN: B3F-1000; OC_FARNELL: 176432; OC_NEWARK: 36M3542
SHIFT1-SHIFT13 = 74xx-eu:74*165: 8-bit parallel load SHIFT REGISTER
SHIFTOUTA SHIFTOUTB SHIFTOUTC SHIFTOUTD SHIFTOUTE SHIFTOUTF SHIFTOUTG SHIFTOUTH SHIFTOUTI SHIFTOUTJ SHIFTOUTK SHIFTOUTL SHIFTOUTM = 74xx-eu:74*595: 8-bit SHIFT REGISTER, output latch
T1 T2 = transistor:*-NPN-: NPN Transistror BF959 corrected 2008.03.06
T3 T9 = transistor-neu-to92:*-NPN-: NPN Transistror BF959 corrected 2008.03.06
U1 = adafruit:DS1307: DS1307 Real time clock (RTC) with battery backup ability. Talk to it via i2c
U3 = SparkFun-Boards:ARDUINO-MEGA: Arduino Mega board footprint
U$1 U$2 = bontor:DCDCMODULE
U$4 = tigorcustom:ESP8266
U$5 = SparkFun:SIMHOLDER3
X1 = microbuilder:SMACONNECTOR: SMA Connector 90° DIP SMA Connector, 50 Ohm (4UConnector: 07259)

## Net classes
1 power: width 0.305 mm, drill 0.6 mm, clearance 0.813 mm
2 GND: width 0.305 mm, drill 0.6 mm, clearance 0.508 mm
3 LIVEAC: width 0.508 mm, drill 0.508 mm, clearance 1.27 mm